# EAGLE design DaslightMux (EAGLE 6.5.0)
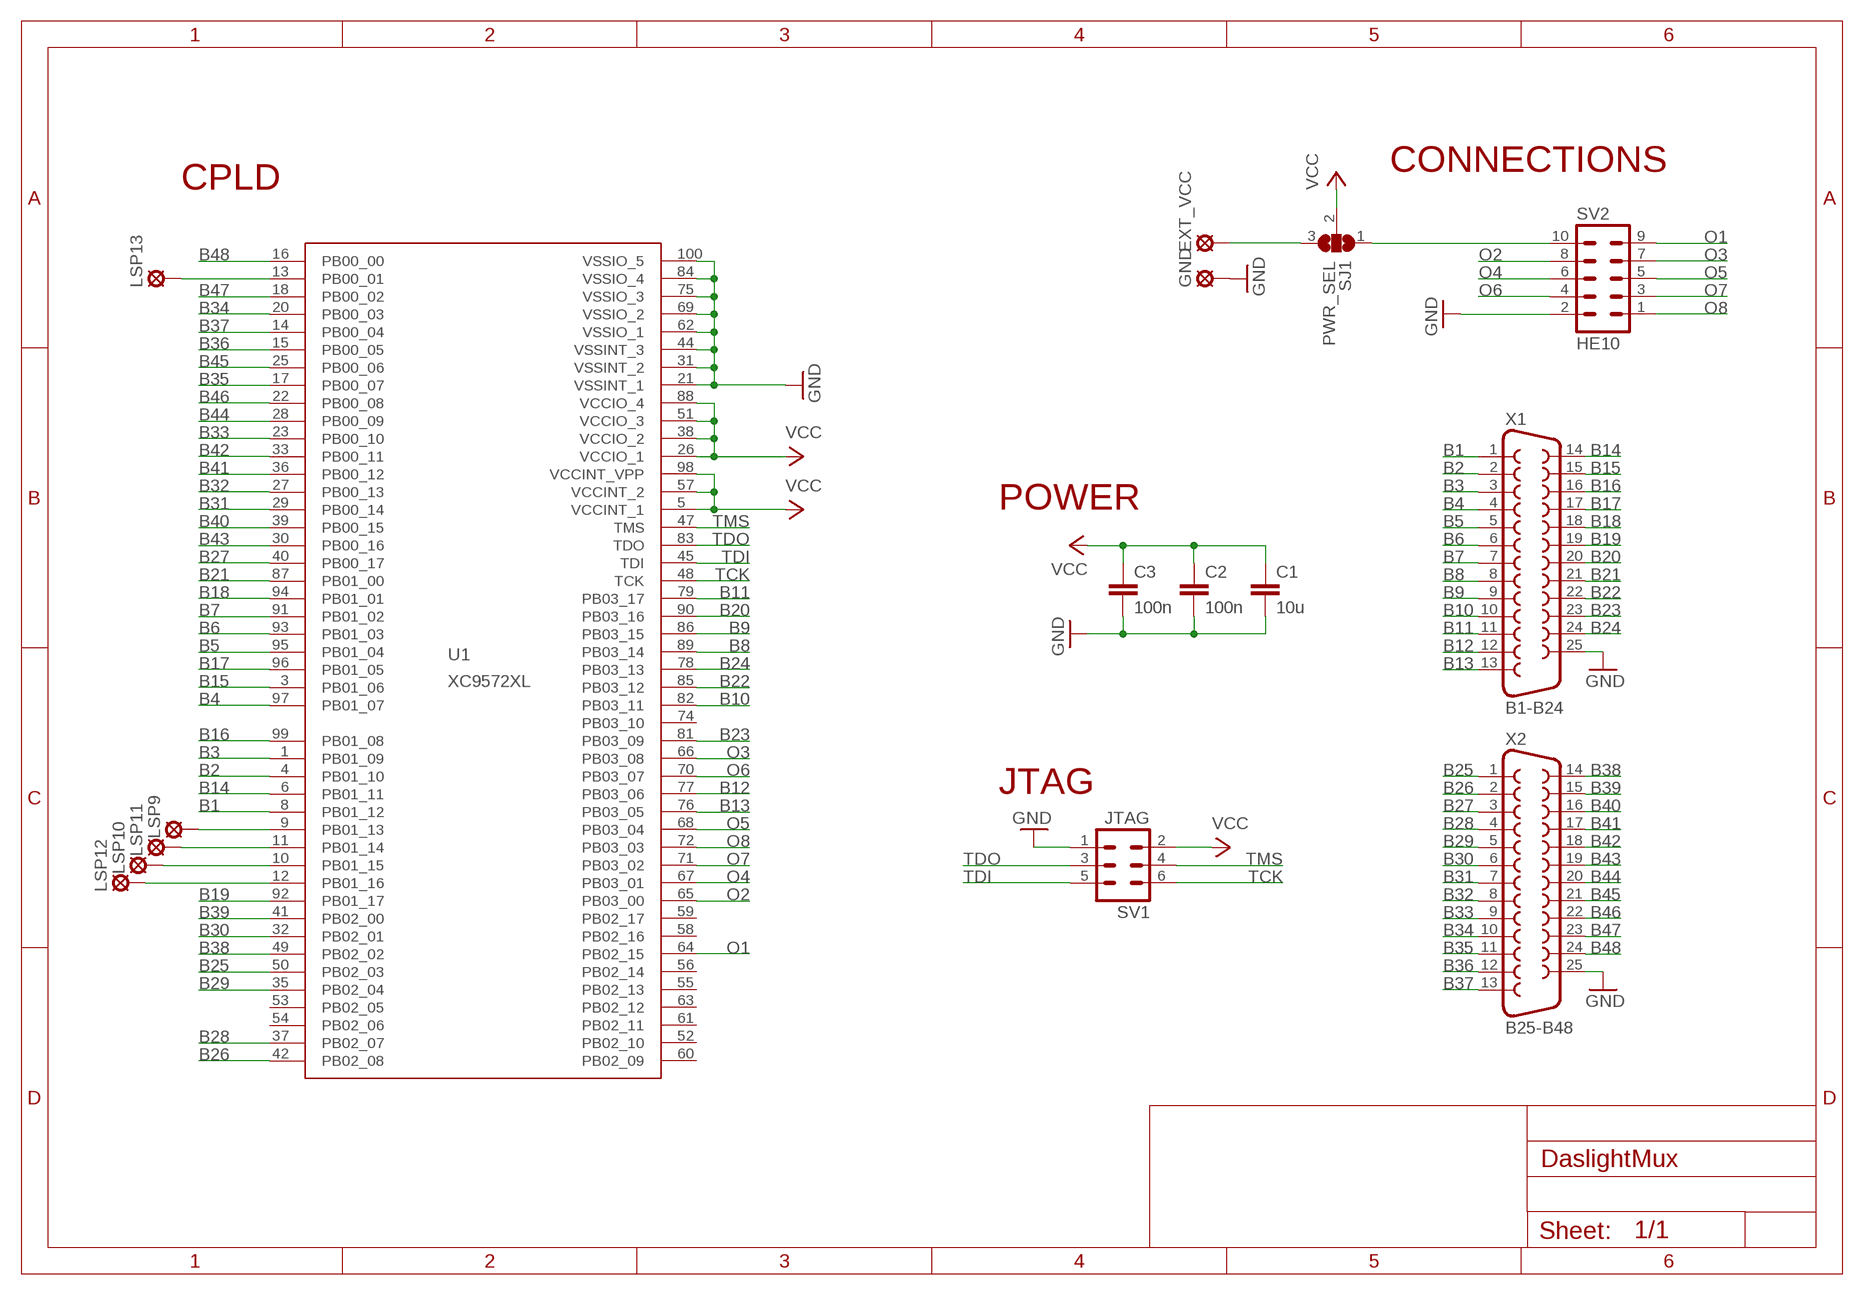
[diagram p0: schematic, sheet 1]

## Parts
C1  10u  C-EUC1206  [C1206]
C2  100n  C-EUC0603  [C0603]
C3  100n  C-EUC0603  [C0603]
EXT_VCC  LSP10  [LSP10]
GND  LSP10  [LSP10]
LSP9  LSP10  [LSP10]
LSP10  LSP10  [LSP10]
LSP11  LSP10  [LSP10]
LSP12  LSP10  [LSP10]
LSP13  LSP10  [LSP10]
SJ1  PWR_SEL  SJ2W  [SJ_2]
SV1  JTAG  MA03-2  [MA03-2]
SV2  HE10  ML10L  [ML10L]
U1  XC9572XL  XC9572XL_TQ100  [TQ100]
X1  B1-B24  F25HP  [F25HP]
X2  B25-B48  F25HP  [F25HP]

## Nets
B1: U1.8(PB01_12) X1.1
B2: U1.4(PB01_10) X1.2
B3: U1.1(PB01_09) X1.3
B4: U1.97(PB01_07) X1.4
B5: U1.95(PB01_04) X1.5
B6: U1.93(PB01_03) X1.6
B7: U1.91(PB01_02) X1.7
B8: U1.89(PB03_14) X1.8
B9: U1.86(PB03_15) X1.9
B10: U1.82(PB03_11) X1.10
B11: U1.79(PB03_17) X1.11
B12: U1.77(PB03_06) X1.12
B13: U1.76(PB03_05) X1.13
B14: U1.6(PB01_11) X1.14
B15: U1.3(PB01_06) X1.15
B16: U1.99(PB01_08) X1.16
B17: U1.96(PB01_05) X1.17
B18: U1.94(PB01_01) X1.18
B19: U1.92(PB01_17) X1.19
B20: U1.90(PB03_16) X1.20
B21: U1.87(PB01_00) X1.21
B22: U1.85(PB03_12) X1.22
B23: U1.81(PB03_09) X1.23
B24: U1.78(PB03_13) X1.24
B25: U1.50(PB02_03) X2.1
B26: U1.42(PB02_08) X2.2
B27: U1.40(PB00_17) X2.3
B28: U1.37(PB02_07) X2.4
B29: U1.35(PB02_04) X2.5
B30: U1.32(PB02_01) X2.6
B31: U1.29(PB00_14) X2.7
B32: U1.27(PB00_13) X2.8
B33: U1.23(PB00_10) X2.9
B34: U1.20(PB00_03) X2.10
B35: U1.17(PB00_07) X2.11
B36: U1.15(PB00_05) X2.12
B37: U1.14(PB00_04) X2.13
B38: U1.49(PB02_02) X2.14
B39: U1.41(PB02_00) X2.15
B40: U1.39(PB00_15) X2.16
B41: U1.36(PB00_12) X2.17
B42: U1.33(PB00_11) X2.18
B43: U1.30(PB00_16) X2.19
B44: U1.28(PB00_09) X2.20
B45: U1.25(PB00_06) X2.21
B46: U1.22(PB00_08) X2.22
B47: U1.18(PB00_02) X2.23
B48: U1.16(PB00_00) X2.24
GND: C1.2 C2.2 C3.2 GND.MP SV1.1 SV2.2 U1.21(VSSINT_1) U1.31(VSSINT_2) U1.44(VSSINT_3) U1.62(VSSIO_1) U1.69(VSSIO_2) U1.75(VSSIO_3) U1.84(VSSIO_4) U1.100(VSSIO_5) X1.25 X2.25
N$1: SJ1.1 SV2.10
N$2: EXT_VCC.MP SJ1.3
N$11: LSP9.MP U1.9(PB01_13)
N$12: LSP10.MP U1.10(PB01_15)
N$13: LSP11.MP U1.11(PB01_14)
N$14: LSP12.MP U1.12(PB01_16)
N$15: LSP13.MP U1.13(PB00_01)
O1: SV2.9 U1.64(PB02_15)
O2: SV2.8 U1.65(PB03_00)
O3: SV2.7 U1.66(PB03_08)
O4: SV2.6 U1.67(PB03_01)
O5: SV2.5 U1.68(PB03_04)
O6: SV2.4 U1.70(PB03_07)
O7: SV2.3 U1.71(PB03_02)
O8: SV2.1 U1.72(PB03_03)
TCK: SV1.6 U1.48(TCK)
TDI: SV1.5 U1.45(TDI)
TDO: SV1.3 U1.83(TDO)
TMS: SV1.4 U1.47(TMS)
VCC: C1.1 C2.1 C3.1 SJ1.2 SV1.2 U1.5(VCCINT_1) U1.26(VCCIO_1) U1.38(VCCIO_2) U1.51(VCCIO_3) U1.57(VCCINT_2) U1.88(VCCIO_4) U1.98(VCCINT_VPP)
Unconnected: U1.52(PB02_10) U1.53(PB02_05) U1.54(PB02_06) U1.55(PB02_13) U1.56(PB02_14) U1.58(PB02_16) U1.59(PB02_17) U1.60(PB02_09) U1.61(PB02_11) U1.63(PB02_12) U1.74(PB03_10)

## Notes on the sheet
- CONNECTIONS
- CPLD
- POWER
- JTAG

## Library data of the parts
C1-C3 = resistor:C-EU: CAPACITOR, European symbol
EXT_VCC GND LSP9-LSP13 = solpad:LSP10: SOLDER PAD drill 1.0 mm, distributor Buerklin, 12H555
SJ1 = jumper:SJ2W: SMD solder JUMPER
SV1 = con-lstb:MA03-2: PIN HEADER; OC_FARNELL: unknown; OC_NEWARK: unknown
SV2 = con-harting-ml:ML10: HARTING; OC_FARNELL: unknown; OC_NEWARK: unknown
U1 = xc9572xl-tq100:XC9572XL_TQ100
X1 X2 = con-subd:F25: SUB-D; OC_FARNELL: unknown; OC_NEWARK: unknown

## Board
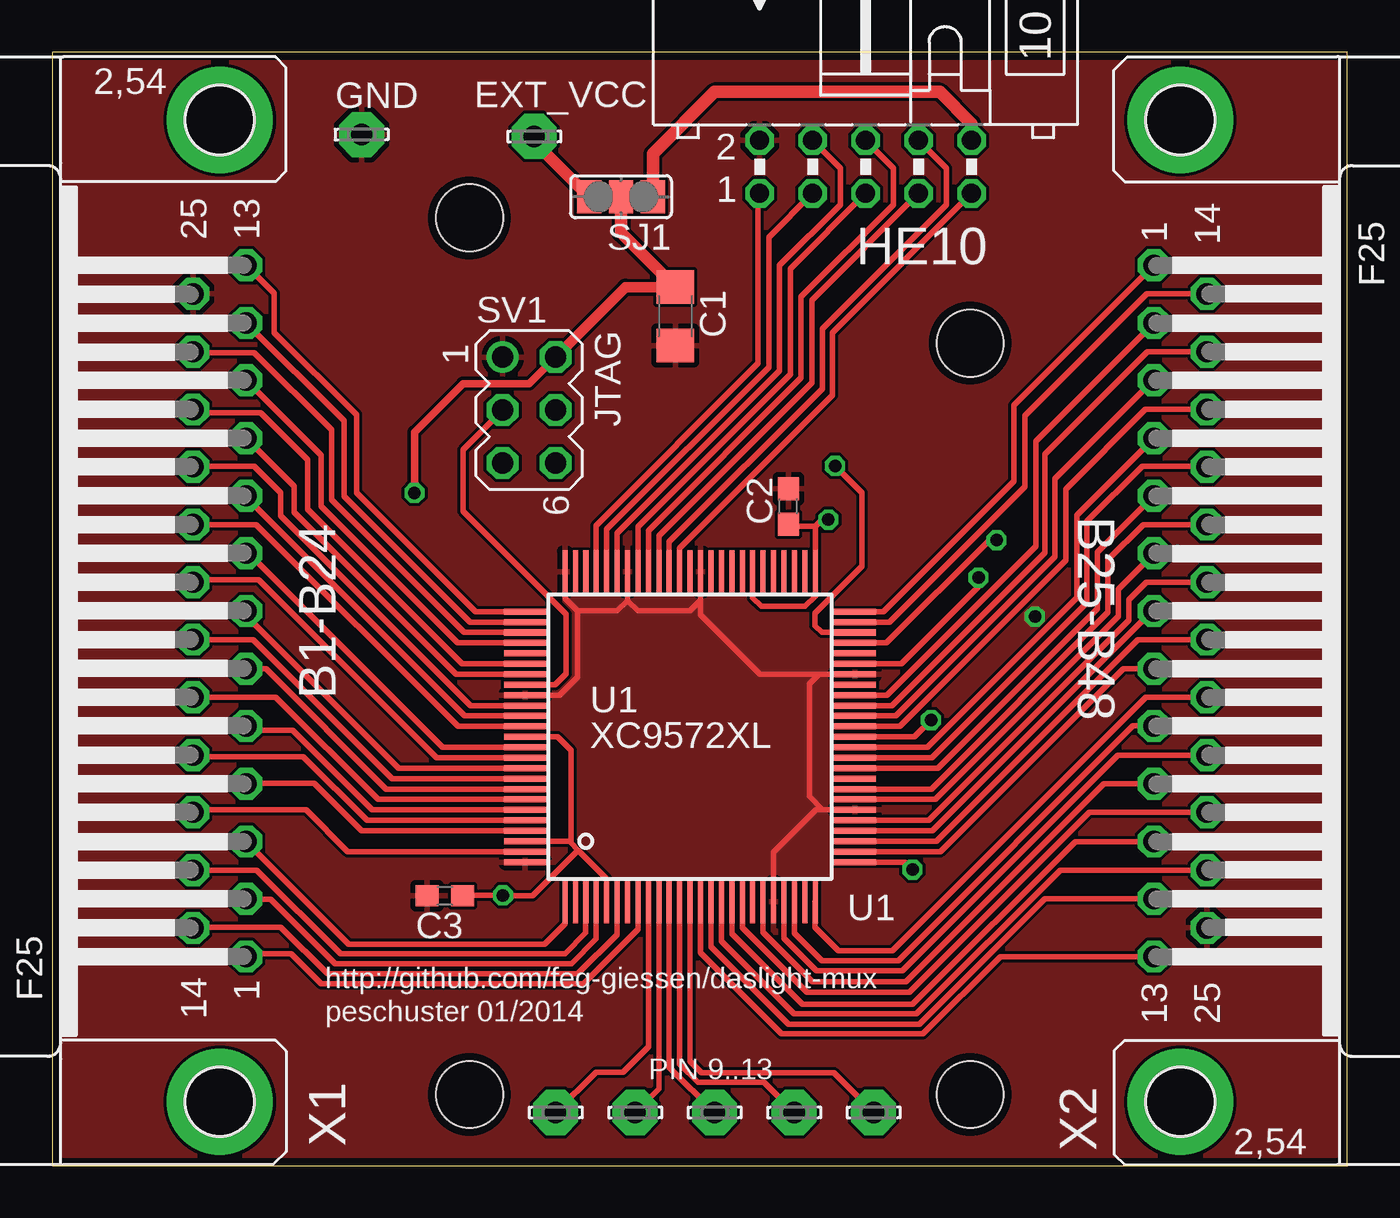
[diagram p1: board, top side]
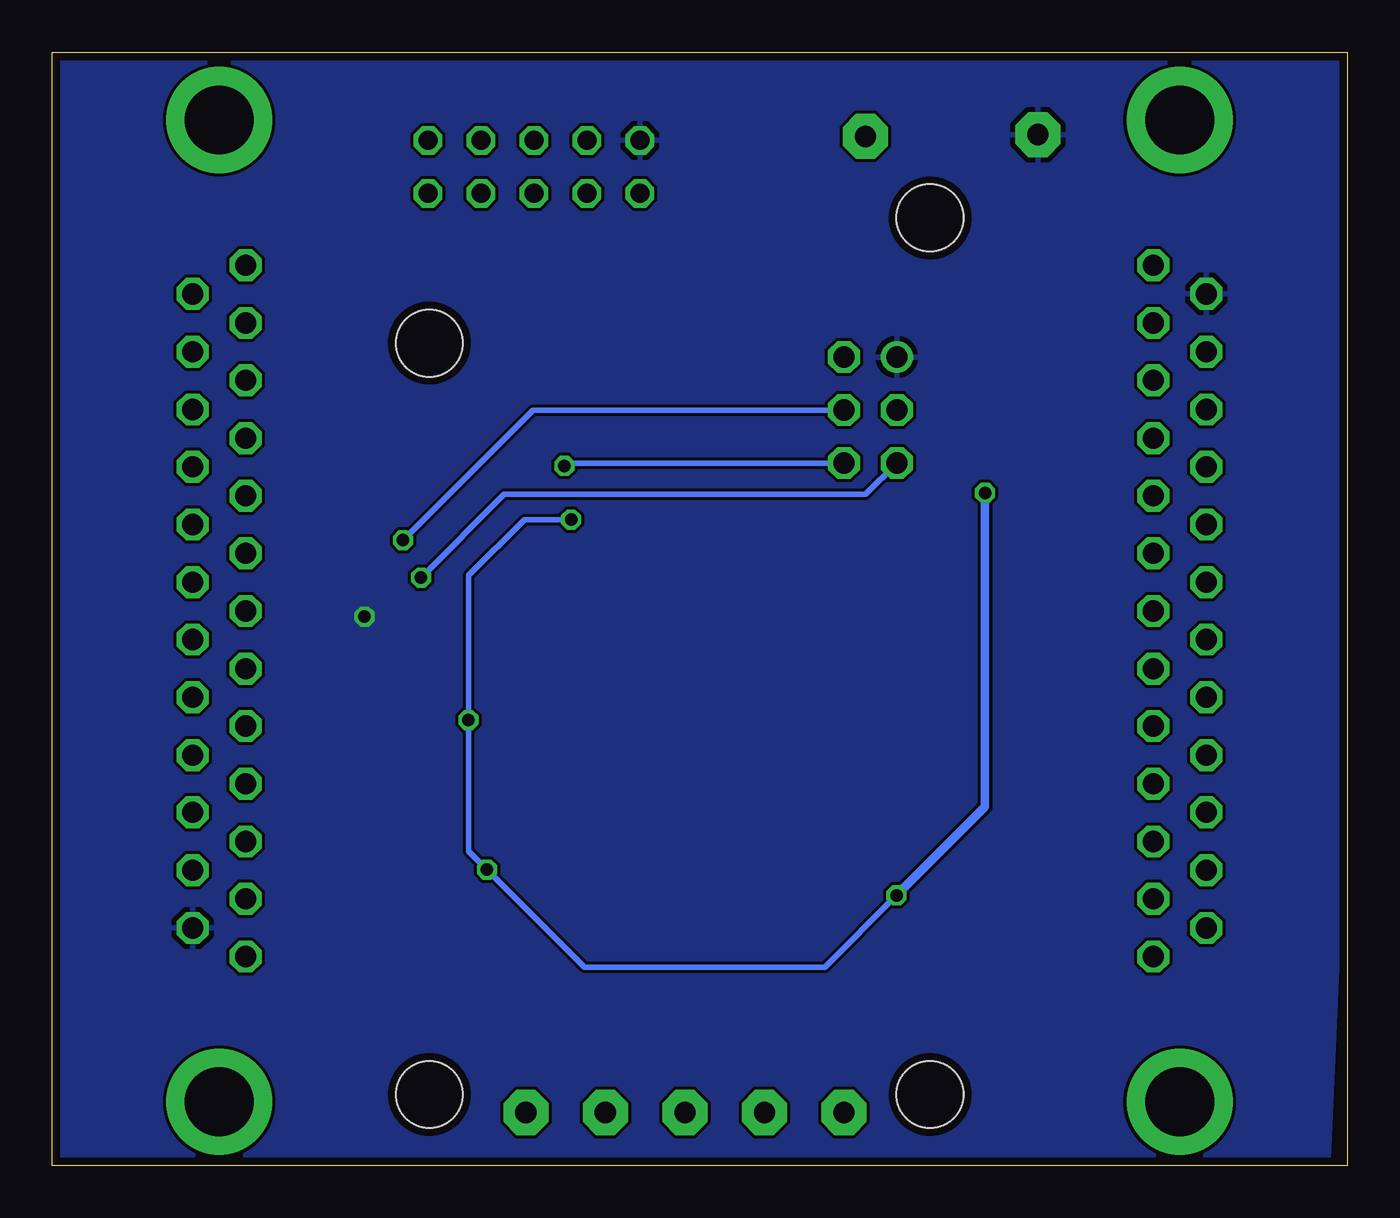
[diagram p2: board, bottom side, seen from below]

Size 62.07 x 53.34 mm. Coordinates in mm from the lower left corner, seen from the top.
Outline: 0,0 62.08,0 62.08,53.34 0,53.34 0,0
Copper layers (1*16): Top 0.0356mm / dielectric 1.5011mm / Bottom 0.0356mm
Design rules "OshPark_PCBOrder *": minimum track width 6mil, minimum drill 13mil, track to track 6mil, track to pad 6mil, pad to pad 6mil, via to via 6mil, smd to smd 6mil, copper to edge 15mil, drill to drill 6mil, minimum pad ring 7mil, minimum via ring 7mil, stop-mask expansion 4mil, vias tented up to drill 0mil, thermal gap 10mil
Holes 3.2 mm at 20,3.4 44,3.4 20,45.4 44,39.4

### Footprints (pad centres in the part's own frame; a part is rotated, then mirrored left to right if it is on the bottom)
C1206 = smd 1.6 x 1.8: 1 -1.4,0; 2 1.4,0
C0603 = smd 1.1 x 1: 1 -0.85,0; 2 0.85,0
LSP10 = drill 1.016 pad 2.159 octagon: MP 0,0
SJ_2 = smd 1.168 x 1.6: 1 -1.524,0; 2 0,0; 3 1.524,0
MA03-2 = drill 1.016: 1 -2.54,-1.27 | drill 1.016 octagon: 2 -2.54,1.27; 3 0,-1.27; 4 0,1.27; 5 2.54,-1.27; 6 2.54,1.27
ML10L = drill 0.914 octagon: 1 -5.08,-1.27; 2 -5.08,1.27; 3 -2.54,-1.27; 4 -2.54,1.27; 5 0,-1.27; 6 0,1.27; 7 2.54,-1.27; 8 2.54,1.27; 9 5.08,-1.27; 10 5.08,1.27
TQ100 = smd 0.254 x 2.032: 1 -6,-7.9; 2 -5.5,-7.9; 3 -5,-7.9; 4 -4.5,-7.9; 5 -4,-7.9; 6 -3.5,-7.9; 7 -3,-7.9; 8 -2.5,-7.9; 9 -2,-7.9; 10 -1.5,-7.9; 11 -1,-7.9; 12 -0.5,-7.9; 13 0,-7.9; 14 0.5,-7.9; 15 1,-7.9; 16 1.5,-7.9; 17 2,-7.9; 18 2.5,-7.9; 19 3,-7.9; 20 3.5,-7.9; 21 4,-7.9; 22 4.5,-7.9; 23 5,-7.9; 24 5.5,-7.9; 25 6,-7.9; 51 6,7.9; 52 5.5,7.9; 53 5,7.9; 54 4.5,7.9; 55 4,7.9; 56 3.5,7.9; 57 3,7.9; 58 2.5,7.9; 59 2,7.9; 60 1.5,7.9; 61 1,7.9; 62 0.5,7.9; 63 0,7.9; 64 -0.5,7.9; 65 -1,7.9; 66 -1.5,7.9; 67 -2,7.9; 68 -2.5,7.9; 69 -3,7.9; 70 -3.5,7.9; 71 -4,7.9; 72 -4.5,7.9; 73 -5,7.9; 74 -5.5,7.9; 75 -6,7.9 | smd 2.032 x 0.254: 26 7.9,-6; 27 7.9,-5.5; 28 7.9,-5; 29 7.9,-4.5; 30 7.9,-4; 31 7.9,-3.5; 32 7.9,-3; 33 7.9,-2.5; 34 7.9,-2; 35 7.9,-1.5; 36 7.9,-1; 37 7.9,-0.5; 38 7.9,0; 39 7.9,0.5; 40 7.9,1; 41 7.9,1.5; 42 7.9,2; 43 7.9,2.5; 44 7.9,3; 45 7.9,3.5; 46 7.9,4; 47 7.9,4.5; 48 7.9,5; 49 7.9,5.5; 50 7.9,6; 76 -7.9,6; 77 -7.9,5.5; 78 -7.9,5; 79 -7.9,4.5; 80 -7.9,4; 81 -7.9,3.5; 82 -7.9,3; 83 -7.9,2.5; 84 -7.9,2; 85 -7.9,1.5; 86 -7.9,1; 87 -7.9,0.5; 88 -7.9,0; 89 -7.9,-0.5; 90 -7.9,-1; 91 -7.9,-1.5; 92 -7.9,-2; 93 -7.9,-2.5; 94 -7.9,-3; 95 -7.9,-3.5; 96 -7.9,-4; 97 -7.9,-4.5; 98 -7.9,-5; 99 -7.9,-5.5; 100 -7.9,-6
F25HP = drill 1.016 octagon: 1 -16.561,-1.27; 2 -13.792,-1.27; 3 -11.049,-1.27; 4 -8.28,-1.27; 5 -5.512,-1.27; 6 -2.769,-1.27; 7 0,-1.27; 8 2.769,-1.27; 9 5.512,-1.27; 10 8.28,-1.27; 11 11.049,-1.27; 12 13.792,-1.27; 13 16.561,-1.27; 14 -15.189,1.27; 15 -12.421,1.27; 16 -9.652,1.27; 17 -6.909,1.27; 18 -4.14,1.27; 19 -1.372,1.27; 20 1.372,1.27; 21 4.14,1.27; 22 6.909,1.27; 23 9.652,1.27; 24 12.421,1.27; 25 15.189,1.27 | drill 3.302 pad 5.08: G1 -23.52,0; G2 23.52,0

### Placement (x,y rotation side)
C1  29.87,40.68 270 top
C2  35.28,31.58 90 top
C3  18.82,12.92 180 top
EXT_VCC  23.1,49.3 0 top
GND  14.83,49.39 0 top
LSP9  24.13,2.54 0 top
LSP10  27.94,2.54 0 top
LSP11  31.75,2.54 0 top
LSP12  35.56,2.54 0 top
LSP13  39.37,2.54 0 top
SJ1  27.26,46.41 180 top
SV1  22.86,36.2 270 top
SV2  38.99,47.84 0 top
U1  30.57,20.54 0 top
X1  8.03,26.57 90 top
X2  54.07,26.57 270 top

### Tracks (layer width: path | path; a pad name or v marks a point on that pad's centre or on a via)
B1
  Top 0.254: U1.8 28.07,11.32 25.47,8.71 12.88,8.71 11.45,10.14 9.44,10.14 X1.1
B2
  Top 0.254: U1.4 26.07,10.85 24.89,9.67 13.56,9.67 10.47,12.76 9.32,12.76 X1.2
B3
  Top 0.254: U1.1 24.57,11.59 23.59,10.61 14.21,10.61 X1.3
B4
  Top 0.254: U1.97 14.83,16.04 12.55,18.32 9.33,18.32 X1.4
B5
  Top 0.254: U1.95 15.34,17.04 11.53,20.86 9.51,20.86 X1.5
B6
  Top 0.254: U1.93 16.02,18.04 10.25,23.8 X1.6
B7
  Top 0.254: U1.91 16.59,19.04 9.3,26.33 X1.7
B8
  Top 0.254: U1.89 18.71,20.04 9.41,29.34 X1.8
B9
  Top 0.254: U1.86 19.77,21.54 9.3,32.01 X1.9
B10
  Top 0.254: U1.82 19.35,23.54 11.6,31.29 11.6,32.55 X1.10
B11
  Top 0.254: U1.79 19.43,25.04 12.88,31.58 12.88,34.04 X1.11
B12
  Top 0.254: U1.77 20.03,26.04 13.99,32.08 13.99,35.67 X1.12
B13
  Top 0.254: U1.76 20.28,26.54 14.58,32.23 14.58,35.96 10.64,39.91 10.64,41.79 X1.13
B14
  Top 0.254: U1.6 27.07,11.06 25.19,9.18 13.2,9.18 10.96,11.42 6.8,11.42 X1.14
B15
  Top 0.254: X1.15 9.81,14.15 13.82,10.14 24.57,10.14 25.57,11.14 U1.3
B16
  Top 0.254: U1.99 14.17,15.04 12.16,17.05 6.89,17.05 X1.16
B17
  Top 0.254: U1.96 15.09,16.54 12.04,19.59 6.84,19.59 X1.17
B18
  Top 0.254: U1.94 15.62,17.54 10.72,22.44 6.78,22.44 X1.18
B19
  Top 0.254: U1.92 16.3,18.54 9.64,25.2 X1.19 6.78,25.18
B20
  Top 0.254: U1.90 18.42,19.54 9.9,28.06 6.88,28.06 X1.20
B21
  Top 0.254: U1.87 19.46,21.04 9.79,30.71 X1.21 6.85,30.62
B22
  Top 0.254: U1.85 20.06,22.04 10.96,31.14 10.96,32.22 9.68,33.5 6.79,33.5 X1.22
B23
  Top 0.254: U1.81 19.64,24.04 12.24,31.43 12.24,33.82 10,36.06 6.92,36.06 X1.23
B24
  Top 0.254: U1.78 19.74,25.54 13.38,31.89 13.38,35.24 9.68,38.95 6.81,38.95 X1.24
B25
  Top 0.254: U1.50 39.84,26.54 46.09,32.78 46.09,36.42 X2.1
B26
  Top 0.254: U1.42 40,22.54 47.14,29.68 47.14,34.7 X2.2
B27
  Top 0.254: U1.40 40.43,21.54 48.07,29.18 48.07,32.9 52.78,37.62 X2.3
B28
  Top 0.254: U1.37 41.94,20.04 49.1,27.2 49.1,31.15 X2.4
B29
  Top 0.254: U1.35 42.45,19.04 50.1,26.68 50.1,29.38 X2.5
B30
  Top 0.254: U1.32 42.33,17.54 51.1,26.31 51.1,27.6 52.8,29.3 X2.6
B31
  Top 0.254: U1.29 42.2,16.04 52.73,26.57 X2.7 52.7,26.48
B32
  Top 0.254: U1.27 42.58,15.04 51.34,23.8 X2.8 52.73,23.73
B33
  Top 0.254: U1.23 35.58,11.13 36.88,9.82 40.55,9.82 51.79,21.06 X2.9
B34
  Top 0.254: X2.10 50.39,18.29 40.92,8.81 36.44,8.81 34.08,11.18 U1.20
B35
  Top 0.254: X2.11 49.03,15.52 41.24,7.73 35.96,7.73 32.58,11.11 U1.17
B36
  Top 0.254: X2.12 47.57,12.78 41.56,6.77 35.28,6.77 31.57,10.48 U1.15
B37
  Top 0.254: X2.13 45.44,10.01 41.73,6.3 34.96,6.3 31.07,10.19 U1.14
B38
  Top 0.254: U1.49 40.14,26.04 46.62,32.52 46.62,35.92 52.47,41.76 X2.14
B39
  Top 0.254: U1.41 40.25,22.04 47.59,29.37 47.59,34.08 52.5,38.99 X2.15
B40
  Top 0.254: U1.39 40.62,21.04 48.58,28.99 48.58,32.41 52.39,36.22 X2.16
B41
  Top 0.254: U1.36 42.17,19.54 49.6,26.97 49.6,30.86 52.25,33.5 55.31,33.5 X2.17
B42
  Top 0.254: U1.33 42.14,18.04 50.6,26.5 50.6,29.02 52.29,30.71 X2.18
B43
  Top 0.254: U1.30 42.01,16.54 51.6,26.13 51.6,27.1 52.44,27.94 X2.19
B44
  Top 0.254: U1.28 42.38,15.54 52.04,25.2 X2.20
B45
  Top 0.254: U1.25 36.56,12.63 36.56,11.42 37.7,10.29 40.28,10.29 52.42,22.43 X2.21
B46
  Top 0.254: X2.22 51.08,19.66 40.75,9.33 36.63,9.33 35.08,10.89 U1.22
B47
  Top 0.254: X2.23 49.71,16.92 41.09,8.3 36.16,8.3 33.08,11.39 U1.18
B48
  Top 0.254: X2.24 48.31,14.15 41.43,7.27 35.56,7.27 32.08,10.76 U1.16
GND  (via drill 0.6)
  Top 0.254: U1.21 34.58,15.01 36.61,17.05 36.92,17.05 | 36.92,17.05 38.47,17.05 U1.31 | U1.44 36.75,23.54 | 36.75,23.54 36.29,23.08 36.29,17.68 36.92,17.05 | 36.75,23.54 33.92,23.54 31.07,26.39 U1.62 31.07,27.07 30.57,26.57 28.07,26.57 27.57,27.06 | U1.75 24.57,27.17 25.18,26.57 | 25.18,26.57 27.08,26.57 27.57,27.06 | U1.69 27.57,27.06 | 25.18,26.57 25.18,23.39 24.32,22.54 U1.84 24.13,22.54
  other vias: 47.1,26.3
  pour Top: -0.54,60.86 69.94,60.86 68.34,-3.93 -2.14,-3.93
  pour Bottom: -1.77,60.96 69.94,60.86 70.27,-2.97 1.05,-2.97
N$1
  Top 0.61: SV2.10 44.06,49.91 42.55,51.44 31.75,51.44 28.79,48.47 SJ1.1
N$2
  Top 0.61: EXT_VCC.MP 23.1,49.05 SJ1.3
N$11
  Top 0.254: U1.9 28.57,5.69 27.36,4.47 26.06,4.47 LSP9.MP
N$12
  Top 0.254: U1.10 29.07,3.67 LSP10.MP
N$13
  Top 0.254: U1.11 29.57,4.71 LSP11.MP
N$14
  Top 0.254: U1.12 30.07,4.85 30.94,3.98 34.12,3.98 LSP12.MP
N$15
  Top 0.254: U1.13 30.57,4.99 31.11,4.45 37.47,4.45 LSP13.MP
O1
  Top 0.254: U1.64 30.07,29.57 37.4,36.9 37.4,39.9 SV2.9
O2
  Top 0.254: U1.65 29.57,29.88 36.92,37.23 36.92,40.1 42.86,46.04 42.86,47.77 SV2.8
O3
  Top 0.254: U1.66 29.07,30.18 36.41,37.51 36.41,41.46 SV2.7
O4
  Top 0.254: U1.67 28.57,30.42 35.9,37.74 35.9,41.61 40.32,46.04 40.32,47.77 SV2.6
O5
  Top 0.254: U1.68 28.07,30.6 35.38,37.91 35.38,42.97 SV2.5
O6
  Top 0.254: U1.70 27.07,30.29 34.87,38.08 34.87,43.12 37.78,46.04 37.78,47.77 SV2.4
O7
  Top 0.254: U1.71 26.57,30.48 34.35,38.25 34.35,44.48 SV2.3
O8
  Top 0.254: U1.72 26.07,30.66 33.84,38.42 33.84,46.51 SV2.1
TCK  (via drill 0.6)
  Top 0.254: v37.52,33.52 38.8,32.24 38.8,28.7 36.56,26.46 36.56,25.86 36.88,25.54 U1.48
  Bottom 0.254: SV1.6 37.39,33.66 v37.52,33.52
TDI  (via drill 0.6)
  Top 0.254: U1.45 40.71,24.04 44.39,27.72 v44.39,28.17
  Bottom 0.254: 44.21,28.17 v44.39,28.17 40.41,32.15 23.09,32.15 SV1.5
TDO
  Top 0.254: U1.83 24.11,23.04 24.63,23.56 24.63,26.41 19.68,31.35 19.68,34.29 SV1.3
TMS  (via drill 0.6)
  Top 0.254: U1.47 40,25.04 44.92,29.96 v45.26,29.96
  Bottom 0.254: SV1.4 39.03,36.2 v45.26,29.96
VCC  (via drill 0.6)
  Top 0.254: U1.88 24.23,20.54 24.86,19.9 24.86,15.58 | 24.86,15.58 24.86,15.46 25.21,15.11 | U1.98 24.82,15.54 24.86,15.58 | U1.5 26.57,13.74 25.21,15.11 | 25.21,15.11 23.02,12.92 21.63,12.92 v21.6,12.94 19.7,12.94 C3.1 | U1.26 40.88,14.54 v41.24,14.18 | U1.38 41.32,20.54 v42.12,21.34 | U1.57 33.58,27.21 34,26.78 36.08,26.78 36.58,27.27 U1.51 36.58,30.62 | C2.1 35.39,30.62 36.58,30.62 | 36.58,30.62 36.9,30.95 v37.2,30.95
  Top 0.356: SV1.2 22.86,37.47 19.68,37.47 17.36,35.14 v17.36,32.22
  Top 0.508: SV1.2 27.48,42.08 C1.1
  Top 0.61: SJ1.2 27.26,44.69 C1.1
  Bottom 0.254: v37.2,30.95 39.45,30.95 42.12,28.27 v42.12,21.34 42.12,15.06 v41.24,14.18 36.56,9.5 25.04,9.5 v21.6,12.94
  Bottom 0.406: v17.36,32.22 17.36,17.18 v21.6,12.94

### Text on the board
tNames: U1 | http://github.com/feg-giessen/daslight-mux | peschuster 01/2014 | PIN 9..13